# Altium schematic sheet ToolSub.SchDoc: Tool Armoury Breakout
size A4; DrawnBy: Luke Hovington; Organization: HSBNE; DocumentNumber: 1; Revision: 1.0; SheetNumber: 1; SheetTotal: 1; ProjectName: Tool Armoury Breakout
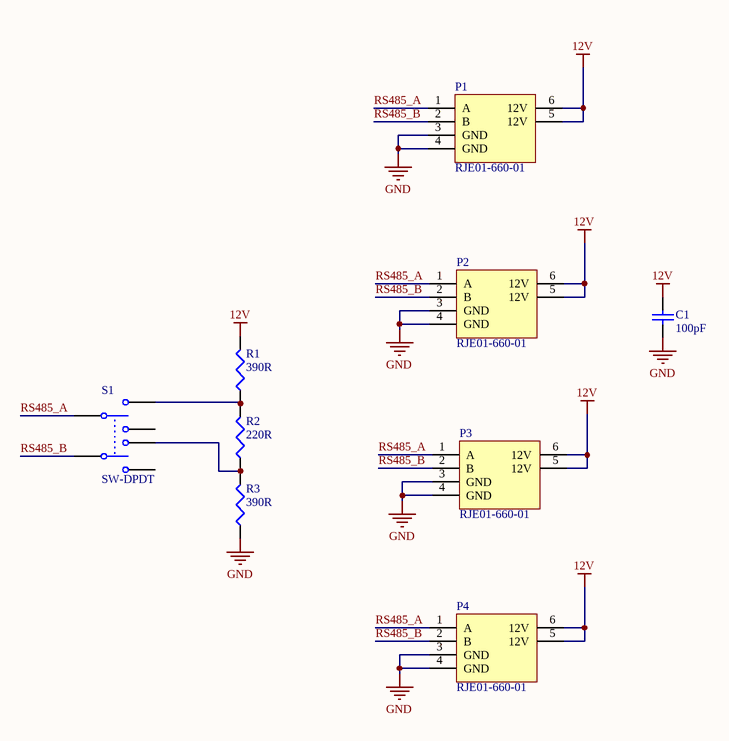
[diagram p0: ToolSub.SchDoc]

## Parts
C1  100pF  [C1206]
P1  RJE01-660-01  [RJ11]
P2  RJE01-660-01  [RJ11]
P3  RJE01-660-01  [RJ11]
P4  RJE01-660-01  [RJ11]
R1  390R  [C1206]  (no BOM)
R2  220R  [C1206]  (no BOM)
R3  390R  [C1206]  (no BOM)
S1  SW-DPDT  [DPDT-6]

## Nets
12V: C1.2 P1.5(12V) P1.6(12V) P2.5(12V) P2.6(12V) P3.5(12V) P3.6(12V) P4.5(12V) P4.6(12V) R1.2
GND: C1.1 P1.3(GND) P1.4(GND) P2.3(GND) P2.4(GND) P3.3(GND) P3.4(GND) P4.3(GND) P4.4(GND) R3.1
RS485_A: P1.1(A) P2.1(A) P3.1(A) P4.1(A) S1.2
RS485_B: P1.2(B) P2.2(B) P3.2(B) P4.2(B) S1.5
NetR1_1: R1.1 R2.2 S1.1
NetR2_1: R2.1 R3.2 S1.6

Not connected (* = marked no-connect by the designer): S1 3 4

## Library data of the parts
C1 = Cap 100pF: Capacitor (Semiconductor SIM Model); Published: 8-Jun-2000; LatestRevisionDate: 29-May-2009; LatestRevisionNote: IPC-7351 Footprint Added.; PackageReference: C1206; Publisher: Altium Limited; PackageDescription: Chip Capacitor; Value: 100pF; Supplier 1: Digi-Key; Supplier 2: Mouser; Supplier Part Number 1: 311-1161-1-ND; Supplier Part Number 2: 581-12065A101J
P1-P4 = RJ11: Supplier 1: Mouser; Supplier 2: Farnell; Supplier Part Number 1: 523-RJE01-660-01; Supplier Part Number 2: 2095366; Supplier 3: Digi-Key; Supplier Part Number 3: RJE0166001-ND
R1 R3 = Resistor-390R: Resistor; Published: 8-Jun-2000; LatestRevisionDate: 29-May-2009; LatestRevisionNote: IPC-7351 Footprint Added.; PackageReference: J1-0603; Publisher: Altium Limited; PackageDescription: Chip Resistor; Value: 390R; Supplier 1: Digi-Key; Supplier Part Number 1: RMCF1206JT390RCT-ND
R2 = Resistor-220R: Resistor; Published: 8-Jun-2000; LatestRevisionDate: 29-May-2009; LatestRevisionNote: IPC-7351 Footprint Added.; PackageReference: J1-0603; Publisher: Altium Limited; PackageDescription: Chip Resistor; Value: 220R; Supplier 1: Digi-Key; Supplier Part Number 1: RMCF1206JT220RCT-ND
S1 = SW-DPDT: Double-Pole, Double-Throw Switch; Published: 24-Mar-1999; LatestRevisionDate: 17-Jul-2002; LatestRevisionNote: Re-released for DXP Platform.; PackageReference: DPDT-6; Publisher: Altium Limited; PackageDescription: Switch; 6 Leads; Supplier 1: Digi-Key; Supplier 2: Mouser; Supplier Part Number 1: 401-2000-ND; Supplier Part Number 2: 611-JS202011AQN